# EAGLE design transmitterArduinoHat (EAGLE 9.6.2)
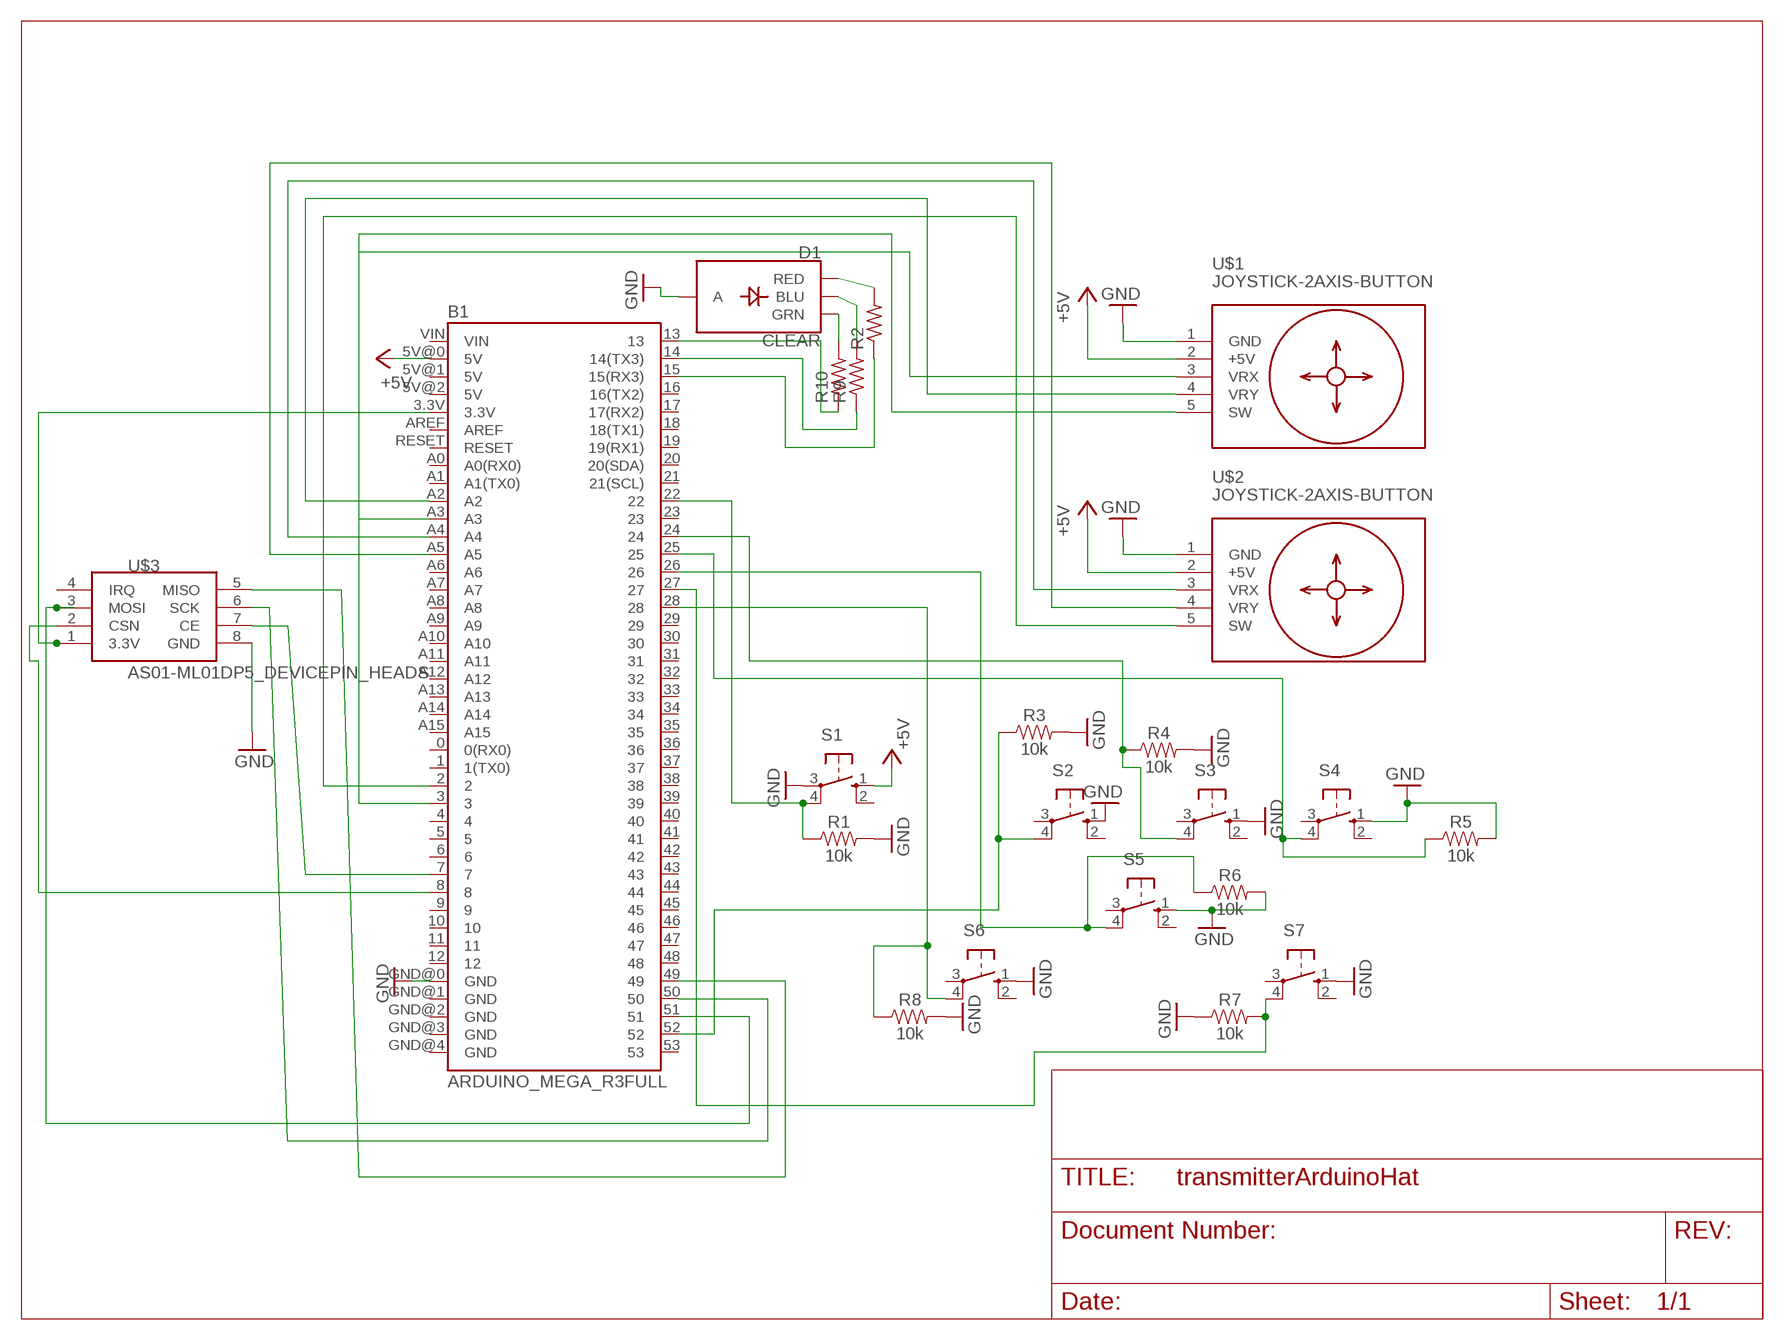
[diagram p0: schematic, sheet 1]

## Parts
B1  ARDUINO_MEGA_R3FULL  [ARDUINO_MEGA]
D1  CLEAR  LED-RGB-CACLEAR  [LED-RGB-THRU]
R1  10k  10KOHM-VERT-1/4W-1%  [AXIAL-0.1]
R2  R-US_V234/12  [V234/12]
R3  10k  10KOHM-VERT-1/4W-1%  [AXIAL-0.1]
R4  10k  10KOHM-VERT-1/4W-1%  [AXIAL-0.1]
R5  10k  10KOHM-VERT-1/4W-1%  [AXIAL-0.1]
R6  10k  10KOHM-VERT-1/4W-1%  [AXIAL-0.1]
R7  10k  10KOHM-VERT-1/4W-1%  [AXIAL-0.1]
R8  10k  10KOHM-VERT-1/4W-1%  [AXIAL-0.1]
R9  R-US_V234/12  [V234/12]
R10  R-US_V234/12  [V234/12]
S1  10-XX  [B3F-10XX]
S2  10-XX  [B3F-10XX]
S3  10-XX  [B3F-10XX]
S4  10-XX  [B3F-10XX]
S5  10-XX  [B3F-10XX]
S6  10-XX  [B3F-10XX]
S7  10-XX  [B3F-10XX]
U$1  JOYSTICK-2AXIS-BUTTON  [JOYSTICK-2AXIS-BUTTON]
U$2  JOYSTICK-2AXIS-BUTTON  [JOYSTICK-2AXIS-BUTTON]
U$3  AS01-ML01DP5_DEVICEPIN_HEADS  [HDRV8W64P254_2X4_1016X508X838B]

## Nets
+5V: B1.5V@0(5V) S1.1(S) U$1.2(+5V) U$2.2(+5V)
GND: B1.GND@0(GND) D1.2(A) R1.P$2 R3.P$2 R4.P$2 R5.P$2 R6.P$2 R7.P$1 R8.P$2 S1.3(P) S2.1(S) S3.1(S) S4.1(S) S5.1(S) S6.1(S) S7.1(S) U$1.1(GND) U$2.1(GND) U$3.8(GND)
N$1: D1.4(BLU) R9.2
N$2: D1.1(RED) R2.2
N$3: B1.22 R1.P$1 S1.4(P1)
N$4: B1.52 R3.P$1 S2.4(P1)
N$5: D1.3(GRN) R10.2
N$6: B1.24 R4.P$1 S3.4(P1)
N$7: B1.25 R5.P$1 S4.4(P1)
N$8: B1.13 R10.1
N$9: B1.14(14(TX3)) R9.1
N$10: B1.26 R6.P$1 S5.4(P1)
N$11: B1.15(15(RX3)) R2.1
N$12: B1.27 R7.P$2 S7.4(P1)
N$13: B1.28 R8.P$1 S6.4(P1)
N$14: B1.3.3V U$3.1(3.3V)
N$15: B1.3 U$1.5(SW)
N$16: B1.2 U$2.5(SW)
N$17: B1.A3 U$1.3(VRX)
N$18: B1.A2 U$1.4(VRY)
N$19: B1.A4 U$2.3(VRX)
N$20: B1.A5 U$2.4(VRY)
N$21: B1.8 U$3.2(CSN)
N$22: B1.7 U$3.7(CE)
N$23: B1.51 U$3.3(MOSI)
N$24: B1.50 U$3.6(SCK)
N$25: B1.49 U$3.5(MISO)
Unconnected: B1.0(0(RX0)) B1.1(1(TX0)) B1.4 B1.5 B1.5V@1(5V) B1.5V@2(5V) B1.6 B1.9 B1.10 B1.11 B1.12 B1.16(16(TX2)) B1.17(17(RX2)) B1.18(18(TX1)) B1.19(19(RX1)) B1.20(20(SDA)) B1.21(21(SCL)) B1.23 B1.29 B1.30 B1.31 B1.32 B1.33 B1.34 B1.35 B1.36 B1.37 B1.38 B1.39 B1.40 B1.41 B1.42 B1.43 B1.44 B1.45 B1.46 B1.47 B1.48 B1.53 B1.A0(A0(RX0)) B1.A1(A1(TX0)) B1.A6 B1.A7 B1.A8 B1.A9 B1.A10 B1.A11 B1.A12 B1.A13 B1.A14 B1.A15 B1.AREF B1.GND@1(GND) B1.GND@2(GND) B1.GND@3(GND) B1.GND@4(GND) B1.RESET B1.VIN S1.2(S1) S2.2(S1) S2.3(P) S3.2(S1) S3.3(P) S4.2(S1) S4.3(P) S5.2(S1) S5.3(P) S6.2(S1) S6.3(P) S7.2(S1) S7.3(P) U$3.4(IRQ)

## Library data of the parts
B1 = SparkFun-Boards:ARDUINO_MEGA_R3: Arduino Mega R3 ATmega2560 R3 compatible footprint. SparkFun Products: Arduino Mega 2560 R3 <https://www.sparkfun.com/products/11061>
D1 = SparkFun-LED:LED-RGB-CA: LED-RGB Diffused Common Anode Packages: LED RGB-THRU P-LCC-4-3 LED-TRICOLOR-SMD SparkFun Products: RGB Diffused Common Anode- Diffuse <[https://www.sparkfun.com/products/10821]> RGB Diffused Common Anode - Clear <[https://www.sparkfun.com/products/10820]> Qduino Mini <[https://www.sparkfun.com/products/13614]> Triple Output LED RGB - SMD <https://www.sparkfun.com/products/7844>; PROD_ID: DIO-10631
R1 R3-R8 = SparkFun-Resistors:10KOHM: 10kΩ resistor A resistor is a passive two-terminal electrical component that implements electrical resistance as a circuit element. Resistors act to reduce current flow, and, at the same time, act to lower voltage levels within circuits. - Wikipedia; PROD_ID: RES-12183
R2 R9 R10 = rcl:R-US_: RESISTOR, American symbol; SPICEPREFIX: R
S1-S7 = switch-omron:10-XX: OMRON SWITCH; MPN: B3F-1000; OC_FARNELL: 176432; OC_NEWARK: 36M3542
U$1 U$2 = joystick:JOYSTICK-2AXIS-BUTTON: 2-Axis Analog Joystick with Push Button Tutorial is available here: http://henrysbench.capnfatz.com/henrys-bench/arduino-sensors-and-input/arduino-ps2-joystick-tutorial-keyes-ky-023-deek-robot/ Click here to find device on ebay.com <http://www.ebay.com/sch/joystick+ps2+module>
U$3 = diy01-arduino-library:AS01-ML01DP5_DEVICE: AS01-ML01DP5 rf transmitter and receiver compatible with arduino and rpi

## Board
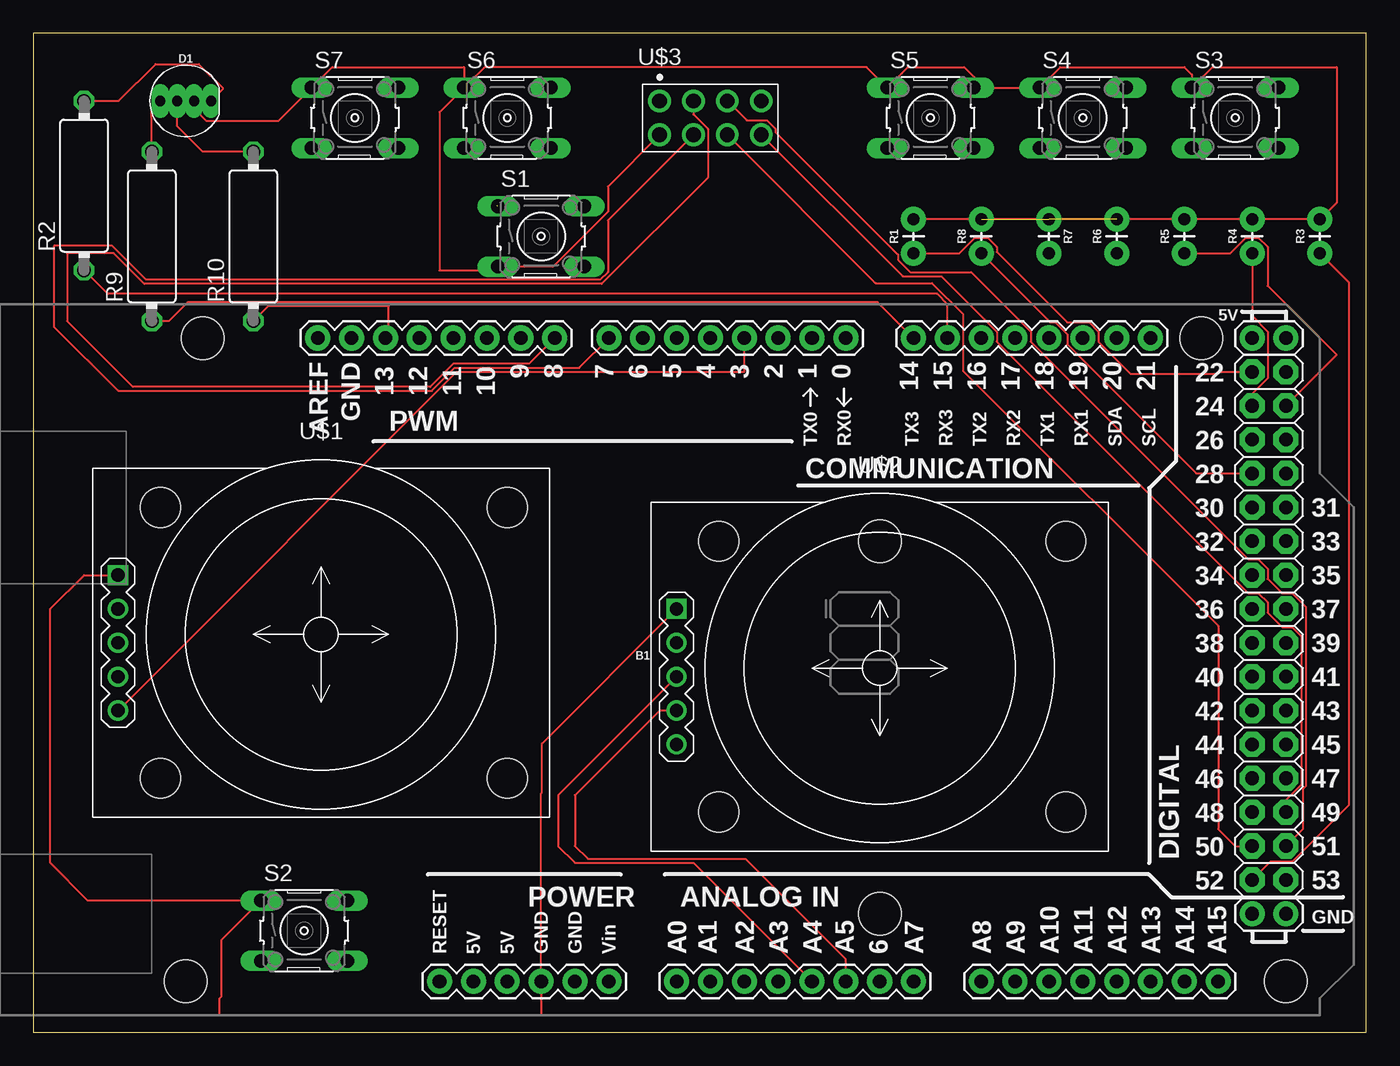
[diagram p1: board, top side]
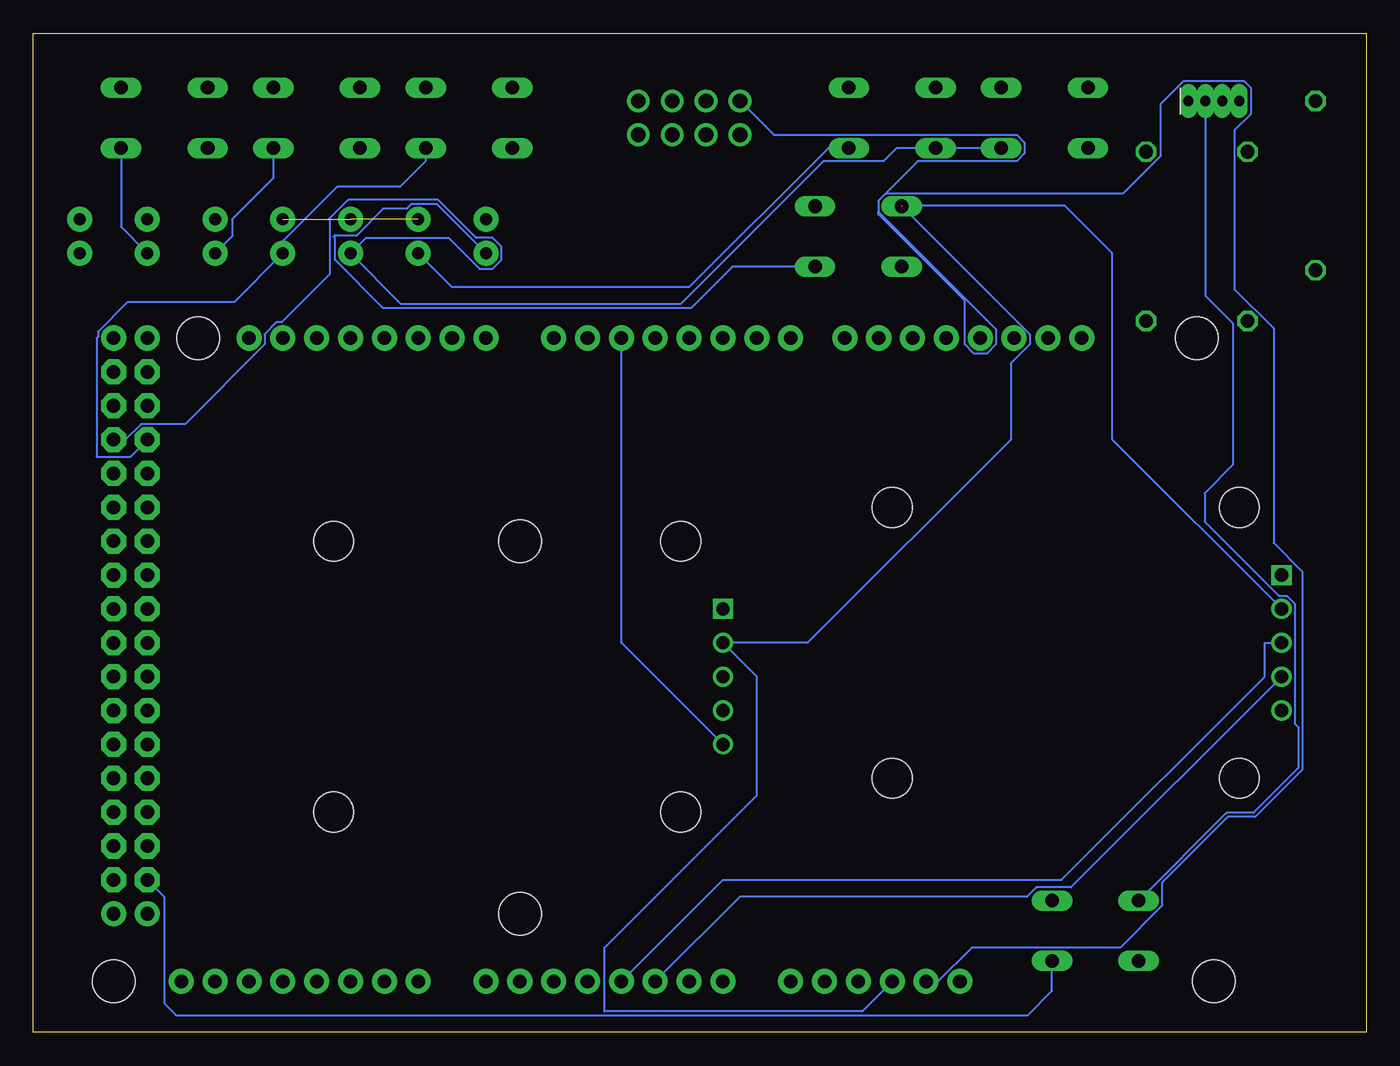
[diagram p2: board, bottom side, seen from below]

Size 100 x 74.92 mm. Coordinates in mm from the lower left corner, seen from the top.
Outline: 0,0 100,0 100,74.92 0,74.92 0,0
Copper layers (1*16): Top 0.035mm / dielectric 1.5mm / Bottom 0.035mm
Design rules "default": minimum track width 6mil, minimum drill 0.35mm, track to track 6mil, track to pad 6mil, pad to pad 6mil, via to via 6mil, smd to smd 6mil, copper to edge 40mil, drill to drill 6mil, minimum pad ring 10mil, minimum via ring 8mil, stop-mask expansion 4mil, vias tented up to drill 0mil, thermal gap 10mil

### Footprints (pad centres in the part's own frame; a part is rotated, then mirrored left to right if it is on the bottom)
ARDUINO_MEGA = drill 1.016 pad 1.88: 0 13.97,24.13; 1 11.43,24.13; 2 8.89,24.13; 3 6.35,24.13; 3.3V -13.97,-24.13; 4 3.81,24.13; 5 1.27,24.13; 5V@0 -11.43,-24.13; 5V@1 44.45,24.13; 5V@2 46.99,24.13; 6 -1.27,24.13; 7 -3.81,24.13; 8 -7.874,24.13; 9 -10.414,24.13; 10 -12.954,24.13; 11 -15.494,24.13; 12 -18.034,24.13; 13 -20.574,24.13; 14 19.05,24.13; 15 21.59,24.13; 16 24.13,24.13; 17 26.67,24.13; 18 29.21,24.13; 19 31.75,24.13; 20 34.29,24.13; 21 36.83,24.13; A0 1.27,-24.13; A1 3.81,-24.13; A2 6.35,-24.13; A3 8.89,-24.13; A4 11.43,-24.13; A5 13.97,-24.13; A6 16.51,-24.13; A7 19.05,-24.13; A8 24.13,-24.13; A9 26.67,-24.13; A10 29.21,-24.13; A11 31.75,-24.13; A12 34.29,-24.13; A13 36.83,-24.13; A14 39.37,-24.13; A15 41.91,-24.13; AREF -25.654,24.13; GND@0 -8.89,-24.13; GND@1 -6.35,-24.13; GND@2 44.45,-19.05; GND@3 46.99,-19.05; GND@4 -23.114,24.13; RESET -16.51,-24.13; VIN -3.81,-24.13 | drill 1.016 pad 1.88 octagon: 22 44.45,21.59; 23 46.99,21.59; 24 44.45,19.05; 25 46.99,19.05; 26 44.45,16.51; 27 46.99,16.51; 28 44.45,13.97; 29 46.99,13.97; 30 44.45,11.43; 31 46.99,11.43; 32 44.45,8.89; 33 46.99,8.89; 34 44.45,6.35; 35 46.99,6.35; 36 44.45,3.81; 37 46.99,3.81; 38 44.45,1.27; 39 46.99,1.27; 40 44.45,-1.27; 41 46.99,-1.27; 42 44.45,-3.81; 43 46.99,-3.81; 44 44.45,-6.35; 45 46.99,-6.35; 46 44.45,-8.89; 47 46.99,-8.89; 48 44.45,-11.43; 49 46.99,-11.43; 50 44.45,-13.97; 51 46.99,-13.97; 52 44.45,-16.51; 53 46.99,-16.51 | hole 3.2: -34.29,24.13; -35.56,-24.13; 16.51,8.89; 16.51,-19.05; 40.64,24.13; 46.99,-24.13
LED-RGB-THRU = drill 0.762 pad 0.889 long: 1 1.905,0; 2 0.635,0; 3 -0.635,0; 4 -1.905,0
AXIAL-0.1 = drill 0.9 pad 1.88: P$1 -1.27,0; P$2 1.27,0
V234/12 = drill 1.016 octagon: 1 -6.35,0; 2 6.35,0
B3F-10XX = drill 1.016 long: 1 -3.251,2.261; 2 3.251,2.261; 3 -3.251,-2.261; 4 3.251,-2.261
JOYSTICK-2AXIS-BUTTON = drill 1 square: 1 -15.24,5.08 | drill 1: 2 -15.24,2.54; 3 -15.24,0; 4 -15.24,-2.54; 5 -15.24,-5.08 | hole 3: -12.065,10.16; -12.065,-10.16; 13.97,-10.16; 13.97,10.16
HDRV8W64P254_2X4_1016X508X838B = drill 1.105 pad 1.705: 1 0,0; 2 2.54,0; 3 5.08,0; 4 7.62,0; 5 7.62,-2.54; 6 5.08,-2.54; 7 2.54,-2.54; 8 0,-2.54

### Placement (x,y rotation side)
B1  46.99,27.94 0 top
D1  11.43,69.85 0 top
R1  66.04,59.69 90 top
R2  3.81,63.5 90 top
R3  96.52,59.69 90 top
R4  91.44,59.69 90 top
R5  86.36,59.69 90 top
R6  81.28,59.69 90 top
R7  76.2,59.69 270 top
R8  71.12,59.69 90 top
R9  8.89,59.69 90 top
R10  16.51,59.69 90 top
S1  38.1,59.69 0 top
S2  20.32,7.62 0 top
S3  90.17,68.58 0 top
S4  78.74,68.58 0 top
S5  67.31,68.58 0 top
S6  35.56,68.58 0 top
S7  24.13,68.58 0 top
U$1  21.59,29.21 0 top
U$2  63.5,26.67 0 top
U$3  46.99,69.85 0 top

### Tracks (layer width: path | path; a pad name or v marks a point on that pad's centre or on a via)
+5V  (1 unrouted)
  Bottom 0.152: U$1.2 19.05,44.45 19.05,58.42 22.61,61.98 34.8,61.98 | S1.1 25.25,52.35 25.25,51.59 26.67,50.16 26.67,44.45 41.91,29.21 U$2.2 45.72,26.67 45.72,17.78 57.15,6.35 57.15,1.57 37.8,1.57 B1.5V@0
GND  (2 unrouted)
  Top 0.152: S6.1 32.31,72.39 22.43,72.39 S7.1 18.39,68.35 12.98,68.35 12.47,68.86 12.47,69.44 D1.2 | S6.1 30.48,69.01 30.48,57.15 34.57,57.15 S1.3 38.99,57.43 43.1,61.54 43.1,63.42 U$3.8 | S6.1 33.86,72.39 62.51,72.39 S5.1 65.61,72.39 69.85,72.39 71.4,70.84 S4.1 77.04,72.39 86.36,72.39 86.92,71.83 S3.1 88.47,72.39 97.79,72.39 97.79,62.23 R3.P$2 R4.P$2 R5.P$2 R6.P$2 R1.P$2 | U$1.1 3.81,34.29 1.27,31.75 1.27,12.7 4.09,9.88 S2.1 14.12,6.93 14.12,2.69 13.97,2.54 13.97,1.27 38.1,1.27 B1.GND@0 38.1,17.92 38.15,17.98 38.15,21.64 U$2.1
  Bottom 0.152: D1.2 12.06,55.24 10.01,53.19 10.01,42.55 12.12,40.44 12.12,38.3 6.55,32.73 5.94,32.73 5.37,32.16 5.37,23.15 5.08,22.86 5.08,19.83 8.45,16.46 10.49,16.46 S2.1
N$1
  Top 0.152: R9.2 8.89,69.22 D1.4
N$2
  Top 0.152: R2.2 6.4,69.85 9.17,72.62 12.42,72.62 14.2,70.84 14.2,70.71 D1.1
N$3
  Top 0.152: R1.P$1 69.47,58.42 70.64,59.59 71.6,59.59 72.29,58.9 72.29,58.52 77.57,53.24 79.22,53.24 79.91,52.55 79.91,51.79 82.32,49.38 88.75,49.38 88.9,49.53 B1.22
  Bottom 0.152: S1.4 47.55,57.43 50.67,54.3 73.74,54.3 77.37,57.94 77.37,59.59 77.47,59.69 77.37,59.79 75.72,59.79 73.76,61.75 73.76,61.79 71.95,61.79 71.6,62.13 69.75,62.13 R1.P$1
N$4
  Top 0.152: B1.52 92.81,12.8 94.46,12.8 98.68,17.02 98.68,56.26 R3.P$1
  Bottom 0.152: B1.52 90.17,10.16 90.17,2.16 89.28,1.27 25.4,1.27 23.57,3.1 S2.4
N$5
  Top 0.152: R10.2 12.7,66.04 10.79,67.94 D1.3
N$6
  Top 0.152: R4.P$1 91.44,53.72 92.61,52.55 92.61,49.05 91.44,47.88 B1.24
  Bottom 0.152: S3.4 93.42,60.4 R4.P$1
N$7
  Top 0.152: R5.P$1 89.79,58.42 90.96,59.59 91.92,59.59 92.61,58.9 92.61,55.98 97.79,50.8 B1.25
  Bottom 0.152: S4.4 81.99,64.06 85.09,60.96 85.09,59.69 R5.P$1
N$8
  Top 0.152: B1.13 26.67,52.32 26.67,54.46 17.63,54.46 R10.1
N$9
  Top 0.152: R9.1 10.16,53.34 11.59,54.76 63.35,54.76 B1.14
N$10
  Bottom 0.152: S5.4 70.56,65.33 72.49,63.4 77.19,63.4 81.28,59.31 R6.P$1 84.94,54.76 92.94,54.76 95.15,52.55 95.15,52.17 95.25,52.07 95.25,43.18 92.71,43.18 B1.26
N$11
  Top 0.152: B1.15 68.58,54.61 67.82,55.37 5.59,55.37 R2.1
N$12
  Bottom 0.152: S7.4 35.23,66.32 36.22,65.33 40.72,65.33 51.44,54.61 72.39,54.61 R7.P$2 75.03,59.59 68.86,59.59 66.52,57.25 65.56,57.25 64.87,57.94 64.87,58.9 65.56,59.59 66.78,59.59 69.62,62.43 76.38,62.43 77.78,61.04 77.78,56.84 81.38,53.24 81.76,53.24 82.65,52.35 82.65,51.59 88.62,45.62 91.92,45.62 93.09,44.45 B1.27
N$13
  Top 0.152: R8.P$1 76.3,53.24 76.68,53.24 77.57,52.35 77.57,51.59 87.25,41.91 B1.28
  Bottom 0.152: S6.4 40.36,66.32 50.8,55.88 68.58,55.88 R8.P$1
N$14
  Bottom 0.152: 36.6,61.54 36.6,62.36 36.02,62.94 | U$3.1 44.45,67.31 26.21,67.31 25.63,66.73 25.63,65.91 26.21,65.33 33.63,65.33 36.02,62.94 | 36.6,61.54 36.6,61.34 30.12,54.87 30.12,51.59 29.44,50.9 28.47,50.9 27.79,51.59 27.79,52.73 36.6,61.54 | 36.02,62.94 18.21,62.94 15.39,65.76 15.39,69.65 13.69,71.35 9.17,71.35 8.66,70.84 8.66,68.86 9.88,67.64 9.88,55.73 6.93,52.78 6.93,36.7 4.78,34.55 4.78,19.7 8.32,16.15 10.37,16.15 15.32,11.2 15.32,9.47 18.44,6.35 29.59,6.35 32.13,3.81 B1.3.3V
N$15
  Top 0.152: U$1.5 31.75,49.53 53.34,49.53 B1.3
N$16
  Bottom 0.152: U$2.5 55.88,29.21 B1.2
N$17
  Bottom 0.152: B1.A3 48.26,11.43 22.86,11.43 7.62,26.67 7.62,29.21 U$1.3
N$18
  Bottom 0.152: U$1.4 22.15,10.87 24.74,10.87 25.45,10.16 46.99,10.16 B1.A2
N$19
  Top 0.152: U$2.3 39.37,17.78 39.37,13.97 40.64,12.7 49.53,12.7 B1.A4
N$20
  Top 0.152: U$2.4 46.99,24.13 40.64,17.78 40.64,13.97 41.6,13.01 53.42,13.01 60.96,5.46 B1.A5
N$21
  Top 0.152: U$3.2 49.53,68.84 50.61,67.76 50.61,64.09 42.65,56.13 8.34,56.13 6.05,58.42 2.54,58.42 2.54,53.34 7.47,48.41 29.77,48.41 31.5,50.14 37.19,50.14 B1.8
N$22
  Top 0.152: U$3.7 43.1,60.88 43.1,57.02 42.52,56.44 8.46,56.44 5.92,58.98 1.55,58.98 1.55,52.93 6.37,48.11 29.9,48.11 31.62,49.84 40.95,49.84 B1.7
N$23
  Top 0.152: U$3.3 53.53,68.39 55.06,68.39 55.69,67.76 55.69,67.5 64.87,58.32 64.87,57.94 65.8,57.01 70.37,57.01 74.83,52.55 74.83,51.79 91.16,35.46 91.92,35.46 92.61,34.77 92.61,34.01 93.7,32.92 94.46,32.92 95.45,31.93 95.45,18.44 95.25,18.24 95.25,15.24 B1.51
N$24
  Top 0.152: U$3.6 63.2,56.19 67.44,56.19 69.75,53.87 69.75,49.63 88.9,30.48 88.9,15.24 90.17,13.97 B1.50
N$25
  Top 0.152: U$3.5 65.23,56.69 68.15,56.69 72.29,52.55 72.29,51.79 91.16,32.92 91.92,32.92 92.61,32.23 92.61,31.47 93.7,30.38 94.46,30.38 95.15,29.69 95.15,18.57 93.98,17.4 B1.49